# EAGLE design TG3_2 (EAGLE 7.7.0)
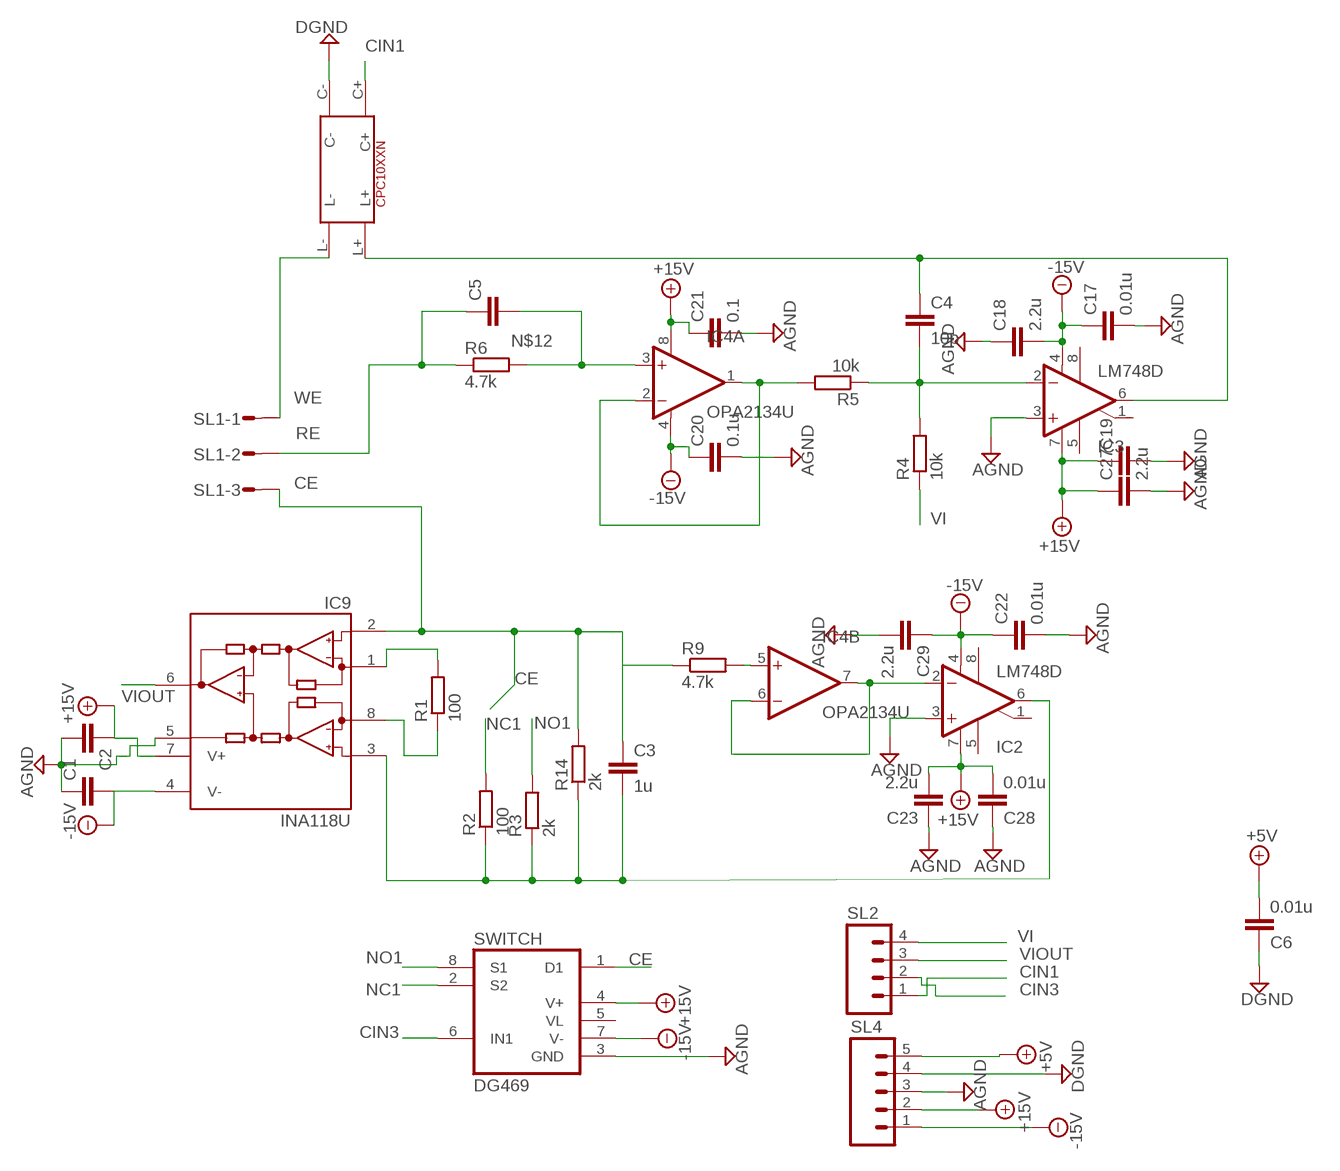
[diagram p0: schematic, sheet 1]

## Parts
C1  C  [C0805]
C2  C  [C0805]
C3  1u  C  [C0805]
C4  10p  C  [C0805]
C5  C  [C0805]
C6  0.01u  C  [C0805]
C17  0.01u  C  [C0805]
C18  2.2u  C  [C0805]
C19  C  [C0805]
C20  0.1u  C  [C0805]
C21  0.1  C  [C0805]
C22  0.01u  C  [C0805]
C23  2.2u  C  [C0805]
C27  2.2u  C  [C0805]
C28  0.01u  C  [C0805]
C29  2.2u  C  [C0805]
IC2  LM748D  [SO08]
IC3  LM748D  [SO08]
IC4  OPA2134U  [SO08]
IC9  INA118U  [SO08]
R1  100  R  [R0805]
R2  100  R  [R0805]
R3  2k  R  [R0805]
R4  10k  R  [R0805]
R5  10k  R  [R0805]
R6  4.7k  R  [R0805]
R9  4.7k  R  [R0805]
R14  2k  R  [R0805]
SL1  M03S  [03P]
SL2  M04  [04P]
SL4  M05  [05P]
SWITCH  DG469  [SO08]
U$5  CPC10XXN  [CPC10XXN]

## Nets
+5V: C6.2 SL4.5
+15V: C2.1 C19.1 C21.1 C23.2 C27.1 C28.2 IC2.7(V+) IC3.7(V+) IC4.8(A:V+) IC9.7(V+) SL4.2 SWITCH.4(V+)
-15V: C1.2 C17.1 C18.2 C20.1 C22.1 C29.1 IC2.4(V-) IC3.4(V-) IC4.4(A:V-) IC9.4(V-) SL4.1 SWITCH.7(V-)
AGND: C1.1 C2.2 C17.2 C18.1 C19.2 C20.2 C21.2 C22.2 C23.1 C27.2 C28.1 C29.2 IC2.3(+IN) IC3.3(+IN) IC9.5(REF) SL4.3 SWITCH.3(GND)
CE: C3.1 IC9.2(-IN) R9.1 R14.2 SL1.3 SWITCH.1(D1)
CIN1: SL2.1 U$5.C+
CIN3: SL2.2 SWITCH.6(IN1)
DGND: C6.1 SL4.4 U$5.C-
N$1: IC9.8(RG) R1.1
N$2: C3.2 IC2.6(OUT) IC9.3(+IN) R2.1 R3.1 R14.1
N$4: IC9.1(RG) R1.2
N$6: IC4.1(A:OUT) IC4.2(A:-IN) R5.2
N$9: C4.2 IC3.2(-IN) R4.2 R5.1
N$12: C5.2 IC4.3(A:+IN) R6.2
N$13: IC2.2(-IN) IC4.6(B:-IN) IC4.7(B:OUT)
N$14: IC4.5(B:+IN) R9.2
N$55: C4.1 IC3.6(OUT) U$5.L+
NC1: R2.2 SWITCH.2(S2)
NO1: R3.2 SWITCH.8(S1)
RE: C5.1 R6.1 SL1.2
VI: R4.1 SL2.4
VIOUT: IC9.6(OUT) SL2.3
WE: SL1.1 U$5.L-
Unconnected: IC2.1(ON/CMP) IC2.5(ON) IC2.8(CMP) IC3.1(ON/CMP) IC3.5(ON) IC3.8(CMP)

## Power pins joined to a net without a drawn wire
VL: SWITCH.5(VL)

## Library data of the parts
C1-C6 C17-C23 C27-C29 = eagle-ltspice:C: CAPACITOR, European symbol; SPICEMODEL: NONE; SPICEPREFIX: C
IC2 IC3 = linear:*748: OP AMP
IC4 = burr-brown:OPA2134: Operational Amplifier; MF: TEXAS INSTRUMENTS; MPN: OPA2134UA; OC_FARNELL: 1206935; OC_NEWARK: 35C1847
IC9 = burr-brown:INA118: Instrumentation Amplifier Precision, Low Power; MF: TEXAS INSTRUMENTS; MPN: INA118U; OC_FARNELL: 1212404; OC_NEWARK: 04M6168
R1-R6 R9 R14 = eagle-ltspice:R: RESISTOR, European symbol; SPICEMODEL: NONE; SPICEPREFIX: R
SL1 = con-amp-quick:M03S: AMP QUICK CONNECTOR; OC_FARNELL: unknown; OC_NEWARK: unknown
SL2 = con-amp-quick:M04: AMP QUICK CONNECTOR; OC_FARNELL: unknown; OC_NEWARK: unknown
SL4 = con-amp-quick:M05: AMP QUICK CONNECTOR; OC_FARNELL: unknown; OC_NEWARK: unknown
SWITCH = maxim:DG469
U$5 = Milib:CPC10XXN

## Board
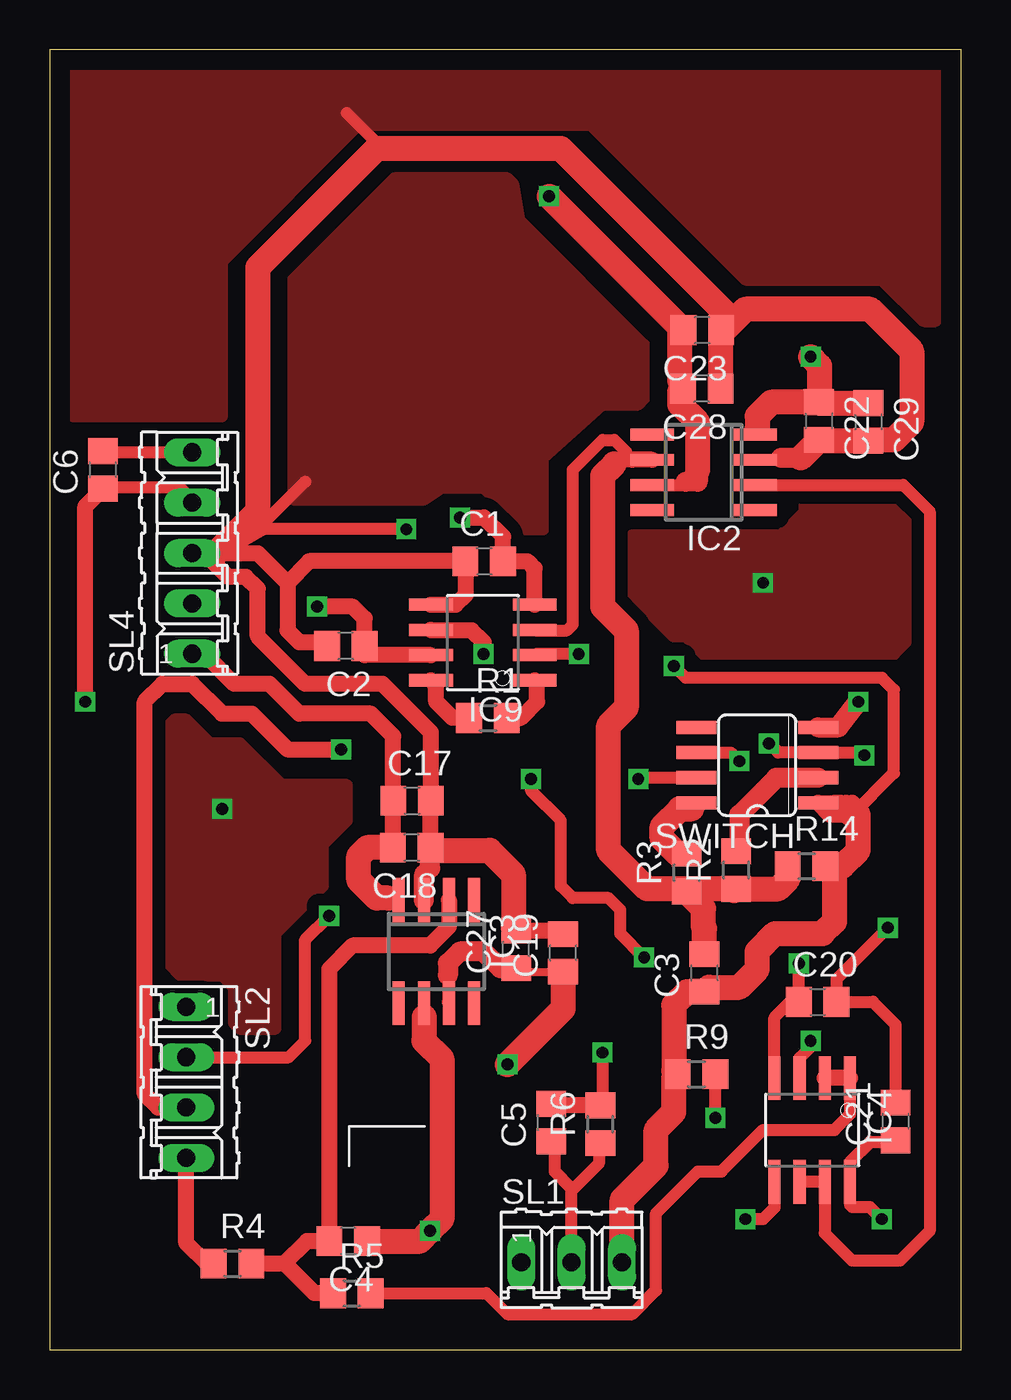
[diagram p1: board, top side]
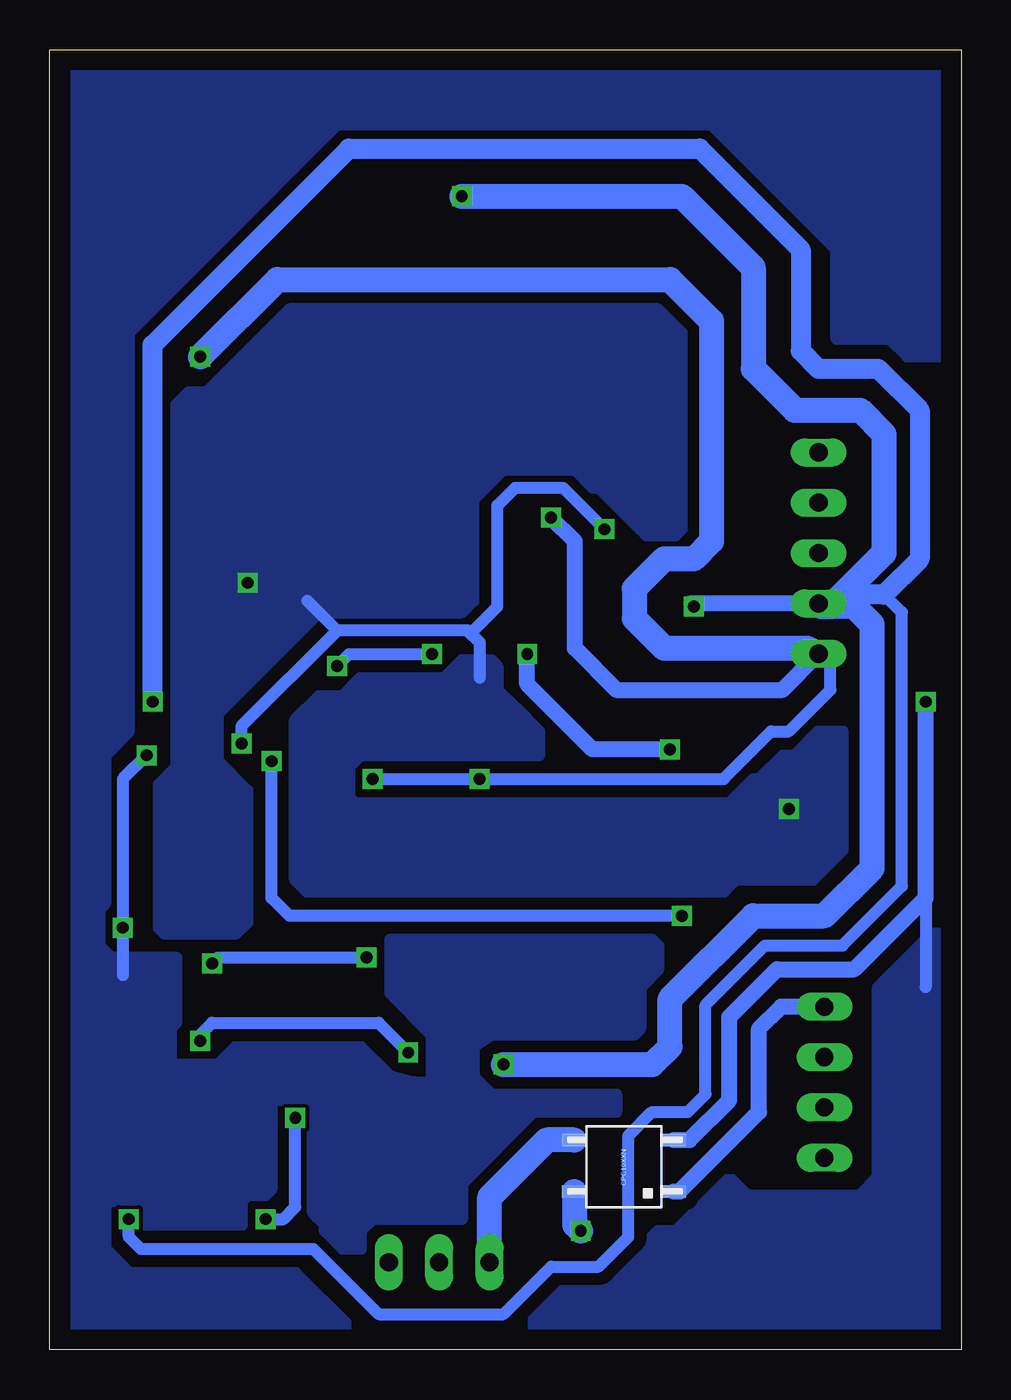
[diagram p2: board, bottom side, seen from below]

Size 46 x 65.6 mm. Coordinates in mm from the lower left corner, seen from the top.
Outline: 0,0 46,0 46,65.6 0,65.6 0,0
Copper layers (1*16): Top 0.035mm / dielectric 1.5mm / Bottom 0.035mm
Design rules "default": minimum track width 10mil, minimum drill 24mil, track to track 8mil, track to pad 8mil, pad to pad 8mil, via to via 8mil, smd to smd 8mil, copper to edge 40mil, drill to drill 8mil, minimum pad ring 10mil, minimum via ring 8mil, stop-mask expansion 4mil, vias tented up to drill 0mil, thermal gap 10mil

### Footprints (pad centres in the part's own frame; a part is rotated, then mirrored left to right if it is on the bottom)
C0805 = smd 1.3 x 1.5: 1 -0.95,0; 2 0.95,0
SO08 = smd 0.6 x 2.2: 1 -1.905,-2.6; 2 -0.635,-2.6; 3 0.635,-2.6; 4 1.905,-2.6; 5 1.905,2.6; 6 0.635,2.6; 7 -0.635,2.6; 8 -1.905,2.6
SO08' = smd 0.61 x 2.21: 1 -1.905,-2.616; 2 -0.635,-2.616; 3 0.635,-2.616; 4 1.905,-2.616; 5 1.905,2.616; 6 0.635,2.616; 7 -0.635,2.616; 8 -1.905,2.616
R0805 = smd 1.3 x 1.5: 1 -0.95,0; 2 0.95,0
03P = drill 0.914 long: 1 -2.54,0; 2 0,0; 3 2.54,0
04P = drill 0.914 long: 1 -3.81,0; 2 -1.27,0; 3 1.27,0; 4 3.81,0
05P = drill 0.914 long: 1 -5.08,0; 2 -2.54,0; 3 0,0; 4 2.54,0; 5 5.08,0
SO08'' = smd 0.66 x 2.032: 1 -1.905,-3.073; 2 -0.635,-3.073; 3 0.635,-3.073; 4 1.905,-3.073; 5 1.905,3.073; 6 0.635,3.073; 7 -0.635,3.073; 8 -1.905,3.073
CPC10XXN = smd 0.635 x 1.27: C+ -1.2,-2.5; C- 1.4,-2.5; L+ -1.2,2.5; L- 1.4,2.5

### Placement (x,y rotation side)
C1  21.93,39.79 0 top
C2  14.95,35.51 180 top
C3  33.04,19.02 90 top
C4  15.07,5.49 180 top
C5  25.31,11.47 90 top
C6  2.7,44.4 90 top
C17  18.29,27.71 0 top
C18  18.27,25.34 180 top
C19  25.91,20.03 90 top
C20  38.75,17.56 0 top
C21  42.69,11.53 90 top
C22  38.81,46.86 270 top
C23  32.93,51.44 180 top
C27  23.54,20.21 90 top
C28  32.91,48.49 180 top
C29  41.31,46.81 270 top
IC2  33,44.27 90 top
IC3  19.52,20.1 180 top
IC4  OPA2134U  [SO08']  38.48,11.1 180 top
IC9  INA118U  [SO08']  21.86,35.69 90 top
R1  22.12,31.88 0 top
R2  34.64,24.21 90 top
R3  32.14,24.08 90 top
R4  9.23,4.36 0 top
R5  15.25,2.86 0 top
R6  27.79,11.39 90 top
R9  32.64,13.91 0 top
R14  38.19,24.41 0 top
SL1  26.34,4.42 0 top
SL2  6.9,13.5 270 top
SL4  7.2,40.2 90 top
SWITCH  DG469  [SO08'']  35.71,29.5 90 top
U$5  17.02,9.19 90 bottom

### Tracks (layer width: path | path; a pad name or v marks a point on that pad's centre or on a via)
+5V
  Top 0.61: SL4.5 2.77,45.28 C6.2
+15V  (via drill 0.6)
  Top 0.406: 23.72,19.08 C19.1
  Top 0.61: 20.1,18.9 20.1,17.55 IC3.7 | IC2.7 31.93,43.63 32.1,43.8 | C21.1 42.61,10.5 41.4,10.5 40.38,9.48 IC4.8 40.38,7.32 40.5,7.2 41.4,7.2 v42,6.6
  Top 0.813: 23.72,19.08 C27.1 | 31.96,48.44 32.1,48.3 32.1,48.6 31.8,48.9 | IC9.7 15.9,35.05 C2.1 15.9,36.9 15.3,37.5 v13.5,37.5
  Top 1.016: C27.1 22.74,19.26 21.9,20.1 20.7,20.1 20.1,19.5 20.1,18.9 | SWITCH.4 39.8,31.41 v40.8,32.7 | 32.7,44.4 32.7,43.8 32.1,43.8
  Top 1.27: 31.98,48.51 C28.2 | C28.2 31.96,48.44 | 32.7,44.4 32.7,46.8 31.8,47.7 31.8,48.33 C28.2 | C19.1 25.91,17.21 v23.1,14.4 | v25.2,58.2 31.96,51.44 C23.2 31.8,51.26 31.8,48.9
  Bottom 0.61: SL4.2 7.06,37.8 6.6,37.8 | 3.9,38.1 3,37.2 3,23.4 6,20.4 9.9,20.4 12.9,17.4 12.9,12.9 13.8,12 15.6,12 16.8,10.8 16.8,5.7 18.3,4.2 20.7,4.2 23.1,1.8 29.4,1.8 32.7,5.1 41.4,5.1 42,5.7 v42,6.6
  Bottom 0.813: SL4.2 13.64,37.66 v13.5,37.5
  Bottom 1.016: v40.8,32.7 40.8,50.7 30.9,60.6 13.2,60.6 8.1,55.5 8.1,50.4 7.2,49.5 4.2,49.5 2.1,47.4 2.1,39.9 3.9,38.1 6,38.1
  Bottom 1.27: v23.1,14.4 15.6,14.4 14.7,15.3 14.7,17.7 10.5,21.9 6.9,21.9 4.5,24.3 4.5,36.6 5.4,37.5 6.6,37.5 | SL4.2 7.04,37.5 6.6,37.5 | v25.2,58.2 14.1,58.2 10.5,54.6 10.5,49.5 8.4,47.4 5.1,47.4 3.9,46.2 3.9,40.2 6,38.1 6.6,37.5
-15V  (via drill 0.6)
  Top 0.406: 35.7,46.5 35.7,46.27 IC2.4
  Top 0.61: IC3.4 17.2,22.7 17.1,22.8 | IC4.4 36.58,16.77 37.5,17.7 | 37.5,17.7 37.64,17.7 C20.1 | SWITCH.7 29.77,28.86 v29.7,28.8 | 37.5,17.7 37.8,18 v37.8,19.5 | v30,19.8 28.8,21 28.8,22.2 28.2,22.8 26.4,22.8 25.8,23.4 25.8,26.7 24.3,28.2 v24.3,28.8
  Top 0.813: C18.2 17.32,27.69 C17.1 17.34,30.96 16.2,32.1 12.6,32.1 11.1,33.6 9.32,33.6 7.8,35.12 SL4.1 | IC9.4 24.48,39.42 24.11,39.79 C1.2 22.88,41.02 21.9,42 v20.7,42
  Top 1.27: 17.1,22.8 16.5,22.8 15.6,23.7 15.6,24.9 16.04,25.34 C18.2 | 38.86,47.76 C22.1 36.41,47.81 35.7,47.1 35.7,46.5 | 38.86,47.76 38.86,49.64 v38.4,50.1 | 38.86,47.76 C29.1
  Bottom 0.61: v29.7,28.8 v24.3,28.8 12,28.8 9.6,31.2 8.7,31.2 6.6,33.3 6.6,34.52 SL4.1 | v37.8,19.5 37.5,19.8 v30,19.8
  Bottom 0.813: v20.7,42 19.5,40.8 19.5,35.4 17.4,33.3 9.02,33.3 SL4.1
  Bottom 1.27: v38.4,50.1 34.5,54 14.7,54 12.6,51.9 12.6,40.8 13.5,39.9 15,39.9 16.5,38.4 16.5,36.9 15,35.4 7.78,35.4 SL4.1
AGND  (via drill 0.6)
  Top 0.61: 18.89,23.68 18.9,23.7 | IC2.3 36.8,44.91 36.9,45 | C21.2 42.69,16.41 41.54,17.56 C20.2 39.7,18.7 v42.3,21.3 | v36.3,30.6 36.77,30.14 SWITCH.3 40.97,30.14 v41.1,30 | v18,41.4 10.8,41.4 8.7,40.2 | 8.7,40.2 8.1,40.2 7.5,40.2 | 21.6,60.6 16.8,60.6 15,62.4 | 8.7,40.2 9.9,41.4 10.5,41.4 12.9,43.8
  Top 0.813: 19.36,25.2 C18.1 19.22,27.69 C17.2 19.24,31.16 16.8,33.6 12.9,33.6 10.5,36 10.5,38.4 9.9,39 9,39 7.8,40.2 | C27.2 25.73,21.16 C19.2 | SL4.3 7.5,40.2 7.8,40.2 | 7.8,40.2 8.1,40.2 8.4,40.2 8.7,40.2 10.5,40.2 12,38.7 | 12,38.7 12,36.3 12.6,35.7 14,35.7 C2.2 | 12,38.7 13.09,39.79 C1.1 21,39.77 21,38.1 20.5,37.59 IC9.5
  Top 1.016: 18.9,23.7 18.9,24 19.2,24.3 19.2,25.32 C18.1 | IC3.3 18.89,23.68 | 37.9,45 36.9,45
  Top 1.27: 19.36,25.2 22.2,25.2 23.4,24 23.4,21.3 C27.2 | 37.9,45 C22.2 38.86,45.86 C29.2 41.35,45.9 42.6,45.9 43.5,46.8 43.5,50.4 41.4,52.5 35.1,52.5 34.2,51.6 | C23.1 33.86,51.42 C28.1 33.86,51.26 34.2,51.6 | 34.2,51.6 34.2,52.2 25.8,60.6 21.6,60.6 16.5,60.6 10.5,54.6 10.5,42.3 8.4,40.2
  Bottom 0.61: v36.3,30.6 36.3,31.5 31.5,36.3 | 24.9,36.3 24.6,36.3 23.4,37.5 23.4,42.6 22.5,43.5 20.1,43.5 v18,41.4 | v41.1,30 42.3,28.8 v42.3,21.3 42.3,18.9 | 24.9,36.3 31.5,36.3 | 31.5,36.3 33,37.8 | 24.9,36.3 24.3,35.7 24.3,33.9
  other vias: 8.7,27.3 36,38.7
  pour Bottom: 14.1,47.7 14.1,51.3 15.3,52.5 33.9,52.5 36.9,49.5 38.1,48.3 39,48.3 39.3,48 39.6,47.7 39.6,29.4 40.5,28.5 40.5,21.3 40.2,21 36.6,21 36,21.6 36,28.2 37.5,29.7 37.5,32.1 32.4,37.2 25.2,37.2 24.6,37.8 24.6,42.9 23.4,44.1 23.1,44.4 19.5,44.4 18.6,43.5 18.3,43.5 16.5,41.7 16.2,41.4 15.9,41.1 14.4,41.1 14.1,41.4
  pour Bottom: 6,29.7 6,25.2 7.5,23.7 11.4,23.7 12,23.1 33,23.1 33.6,23.7 33.6,31.8 32.4,33 31.2,33 30.3,33.9 26.1,33.9 25.5,34.5 25.2,34.8 23.7,34.8 23.4,34.5 23.4,33.3 22.5,32.4 21.3,31.2 21.3,30.3 21.3,30 30.3,30 30.9,29.4 30.9,27.9 30.6,27.6 11.7,27.6 10.5,28.8 10.2,28.8 9,30 8.4,30 7.2,31.2 6,31.2
  pour Bottom: 39.6,19.8 39.6,16.5 39.9,16.2 39.9,14.4 37.5,14.4 36.6,15.3 30.3,15.3 28.8,13.8 27.6,13.5 26.7,13.5 26.7,15.9 28.8,18 28.8,20.7 15.6,20.7 15.3,20.4 15.3,19.2 16.2,18.3 16.2,16.2 16.5,15.9 23.7,15.9 24.6,15.3 24.6,13.8 23.7,12.9 17.4,12.9 17.4,12 21.6,12 25.2,8.4 25.2,6.6 29.7,6.6 30.3,6 30.3,5.1 31.2,5.1 32.1,6 32.1,6.3 32.7,6.9 32.7,12.6 34.8,12.6 34.8,8.1 35.1,7.8 36,7.8 36.3,7.5 36.3,6.3 41.1,6.3 41.1,7.5 43.2,7.5 43.2,5.1 42,3.9 33.6,3.9 30.9,1.2 30.9,0.6 44.7,0.6 45,0.9 45,64.5 44.7,64.8 1.2,64.8 0.9,64.5 0.9,50.1 2.7,50.1 3.6,51 6.3,51 6.3,55.5 12.6,61.8 31.5,61.8 42,51.3 42,31.2 43.2,30 43.2,22.5 43.5,22.2 43.5,20.4 42.9,19.8
  pour Top (isolate 0.61): 1.2,47.1 8.7,47.1 8.7,54.9 15.6,61.8 27.3,61.8 34.5,54.6 35.1,54 42,54 44.1,51.9 44.7,51.9 45,52.2 45,64.2 44.4,64.8 1.5,64.8 0.9,64.2 0.9,47.4
  pour Top (isolate 0.61): 12.3,42.9 18.9,42.9 19.8,43.5 21.9,43.5 24,41.4 24.9,41.4 24.9,45 27.9,47.7 29.7,47.7 30,48 30,50.7 23.7,57 23.4,58.8 23.1,59.1 17.4,59.1 12.3,54
  pour Top (isolate 0.61): 6,30.6 6,19.5 6.6,18.9 8.7,18.9 9.3,18.3 9.3,16.5 9.6,16.2 11.4,16.2 11.4,21 13.8,23.4 13.8,25.5 15,26.7 15,28.5 11.7,28.5 9.6,30.6 8.1,30.6 6.9,31.8 6.3,31.8 6,31.5
  pour Top (isolate 0.61): 29.7,41.1 36.9,41.1 38.1,42.3 38.1,42.6 42.6,42.6 43.2,42 43.2,35.7 42.6,35.1 33,35.1 32.1,36 31.5,36 29.4,38.1 29.4,41.1
CE  (via drill 0.6)
  Top 0.61: 39.3,27.3 40.5,27 42.6,29.1 42.6,33.3 42,33.9 32.1,33.9 v31.5,34.5 | v26.7,35.1 24.52,35.1 IC9.2
  Top 0.813: 40.5,27 39.9,27.6 | 39.9,27.6 40.2,27.6 | 40.2,27.6 40.5,27.6 40.8,27.3 40.5,27 | 40.5,27 39.38,27 SWITCH.1 40.2,27.59 40.2,27.6 | 39.9,27.6 39.6,27.6 39.3,27.3
  Top 1.27: SL1.3 28.88,7.58 30.6,9.3 30.6,11.1 31.5,12 31.5,13.72 R9.1 31.5,14.1 31.5,17.4 32.17,18.07 C3.1 33.27,18.3 34.8,18.3 35.7,19.2 35.7,20.1 36.6,21 39,21 39.6,21.6 39.6,23.95 R14.2 40.01,24.41 40.8,25.2 40.8,27 40.5,27.3 40.5,27
  Bottom 0.61: v31.5,34.5 30.9,35.1 v26.7,35.1
CIN1
  Bottom 0.813: U$5.C+ 14.21,7.99 10.2,12 10.2,16.2 9.09,17.31 SL2.1
CIN3  (via drill 0.6)
  Top 0.61: SL2.2 12.07,14.77 12.9,15.6 12.9,20.7 v14.1,21.9 | v34.8,29.7 34.37,30.14 SWITCH.6
  Bottom 0.61: v14.1,21.9 33.9,21.9 34.8,22.8 v34.8,29.7
DGND  (via drill 0.6)
  Top 0.61: SL4.4 7.2,42.9 6.6,43.5 2.75,43.5 C6.1
  Top 0.813: v1.8,32.7 1.8,42.55 C6.1
  Bottom 0.61: 1.8,27.9 1.8,18.3
  Bottom 0.813: U$5.C- 13.71,10.59 11.7,12.6 11.7,16.8 9.3,19.2 5.4,19.2 1.8,22.8 1.8,27.9 v1.8,32.7
  pour Bottom (isolate 0.61): 0.9,21 0.9,1.2 1.5,0.6 21,0.6 21.6,1.2 21.6,1.5 20.1,3 18.3,3 15.3,6 14.4,6 11.7,8.7 10.8,7.8 5.1,7.8 4.2,8.7 4.2,18.3 1.5,21
N$1
  Top 0.813: R1.1 20.32,31.88 19.5,32.7 19.5,33.53 IC9.8
N$2
  Top 0.406: 24.5,36.3 IC9.3
  Top 0.61: 24.5,36.3 26.1,36.3 26.4,36.6 26.4,44.4 27.9,45.9 28.5,45.9 29.1,45.3 29.1,45.2 29.4,44.91
  Top 0.813: IC2.6 29.4,44.91 28.7,44.91 28.5,44.7
  Top 1.27: 34.54,23.16 R2.1 | R2.1 32.27,23.26 | 32.27,23.26 R3.1 33,22.27 33,21.3 33.04,21.26 C3.2 | R14.1 37.24,23.74 36.76,23.26 R2.1 | 32.27,23.26 30.14,23.26 28.2,25.2 28.2,31.5 29.1,32.4 29.1,36.3 27.9,37.5 27.9,44.1 28.5,44.7
N$4
  Top 0.813: R1.2 23.78,31.88 24.6,32.7 24.6,33.66 IC9.1
N$6
  Top 0.61: R5.2 22.04,2.86 23.1,1.8 29.4,1.8 30.6,3 30.6,6.9 32.7,9 33.9,9 36,11.1 39.6,11.1 40.38,11.88 IC4.1
  Top 0.813: IC4.1 IC4.2
N$9
  Top 0.813: R4.2 11.86,4.36 | 11.86,4.36 12.99,5.49 C4.2 14.12,19.22 15.3,20.4 19.2,20.4 20.16,21.36 IC3.2 | R5.1 13.36,2.86 11.86,4.36
N$12  (via drill 0.6)
  Top 0.61: IC4.3 37.84,14.74 38.4,15.3 v38.4,15.6 | v27.9,15 27.9,12.45 R6.2
  Top 0.813: R6.2 25.39,12.34 C5.2
  Bottom 0.61: v38.4,15.6 38.4,15.9 37.8,16.5 29.4,16.5 v27.9,15
N$13
  Top 0.61: IC2.2 43.06,43.63 44.4,42.3 44.4,6 42.9,4.5 40.5,4.5 39.12,5.88 IC4.7 IC4.6
N$14  (via drill 0.6)
  Top 0.61: IC4.5 36.58,7.17 36,6.6 v35.1,6.6 | v33.6,11.7 R9.2
  Bottom 0.61: v35.1,6.6 34.2,6.6 33.6,7.2 v33.6,11.7
N$55  (via drill 0.6)
  Top 0.61: IC3.6 18.89,16.82 18.9,16.8
  Top 1.27: C4.1 18.69,5.49 v19.2,6 19.8,6.6 19.8,14.7 18.9,15.6 | 18.89,15.62 18.9,15.6 | 18.9,16.8 18.9,15.6
  Bottom 1.27: v19.2,6 19.5,6.3 19.5,7.97 U$5.L+
NC1
  Top 1.016: SWITCH.2 36.66,28.86 34.8,27 34.8,25.32 R2.2
NO1
  Top 0.406: 32.4,27.3 32.4,27.36 SWITCH.8
  Top 1.27: R3.2 31.67,25.03 30.9,25.8 30.9,26.4 31.8,27.3 32.4,27.3
RE
  Top 0.61: SL1.2 26.34,8.16 | 26.34,8.16 25.5,9 25.5,10.33 | 27.71,10.52 27.71,9.41 26.46,8.16 26.34,8.16
  Top 0.813: 25.5,10.33 C5.1 | 27.71,10.52 R6.1
VI
  Top 0.813: R4.1 7.94,4.36 6.9,5.4 SL2.4
VIOUT  (via drill 0.6)
  Top 0.813: SL2.3 5.47,12.23 4.8,12.9 4.8,32.7 5.7,33.6 7.2,33.6 8.7,32.1 10.2,32.1 12,30.3 v14.7,30.3 | v21.9,35.1 21.9,35.7 21.3,36.3 19.27,36.3 IC9.6
  Bottom 0.813: v14.7,30.3 18.6,30.3 21.9,33.6 v21.9,35.1
WE
  Bottom 1.27: SL1.1 23.8,7.7 20.91,10.59 U$5.L-